# EAGLE design wifi-advent-wings (EAGLE 7.6.4)
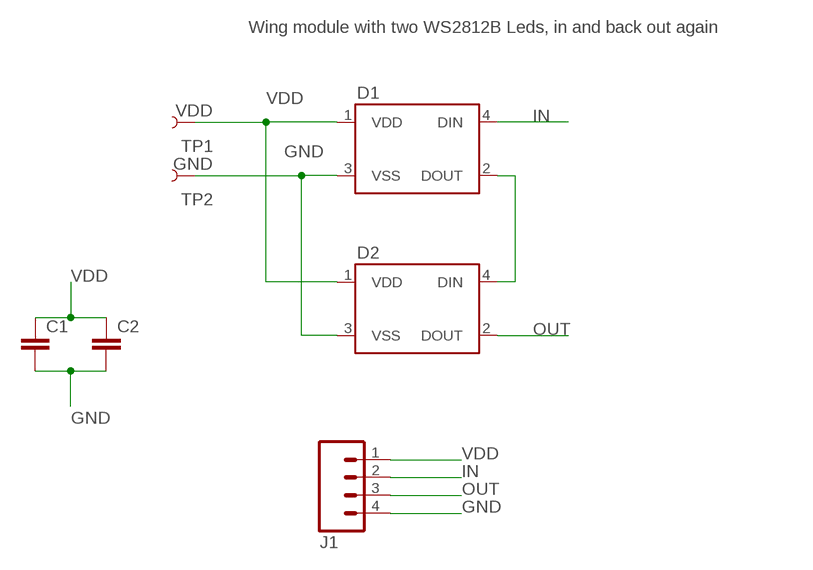
[diagram p0: schematic, sheet 1]

## Parts
C1  CAP0805  [0805]
C2  CAP0805  [0805]
D1  WS2812B  [WS2812B]
D2  WS2812B  [WS2812B]
J1  M041X04_NO_SILK  [1X04_NO_SILK]
TP1  VDD  TEST-POINT3  [PAD.03X.03]
TP2  GND  TEST-POINT3  [PAD.03X.03]

## Nets
GND: C1.2 C2.2 D1.3(VSS) D2.3(VSS) J1.4 TP2.P$1
IN: D1.4(DIN) J1.2
N$1: D1.2(DOUT) D2.4(DIN)
OUT: D2.2(DOUT) J1.3
VDD: C1.1 C2.1 D1.1(VDD) D2.1(VDD) J1.1 TP1.P$1

## Notes on the sheet
- Wing module with two WS2812B Leds, in and back out again

## Library data of the parts
C1 C2 = SparkFun-Passives:CAP: Capacitor Standard 0603 ceramic capacitor, and 0.1" leaded capacitor.
D1 D2 = karls-parts-2016-09:WS2812B: WS2812B - Intelligent control LED integrated light source Technical Specifications: Power Supply Voltage (VDD): 3.5 to 5.3 V Input Voltage (VI): -0.5 to VDD+0.5 V Operating Junction Temperature (Topt): -25°C to +80°C Storage Temperature Range (Tstg): -55°C to +150°C; PROD_ID: DIO-12503
J1 = SparkFun-Connectors:M04: Header 4 Standard 4-pin 0.1" header. Use with straight break away headers (SKU : PRT-00116), right angle break away headers (PRT-00553), swiss pins (PRT-00743), machine pins (PRT-00117), and female headers (PRT-00115). Molex polarized connector foot print use with SKU : PRT-08231 with associated crimp pins and housings. 1MM SMD Version SKU: PRT-10208; PROD_ID: CONN-09696
TP1 TP2 = SparkFun-Passives:TEST-POINT: Bare copper test points for troubleshooting or ICT

## Board
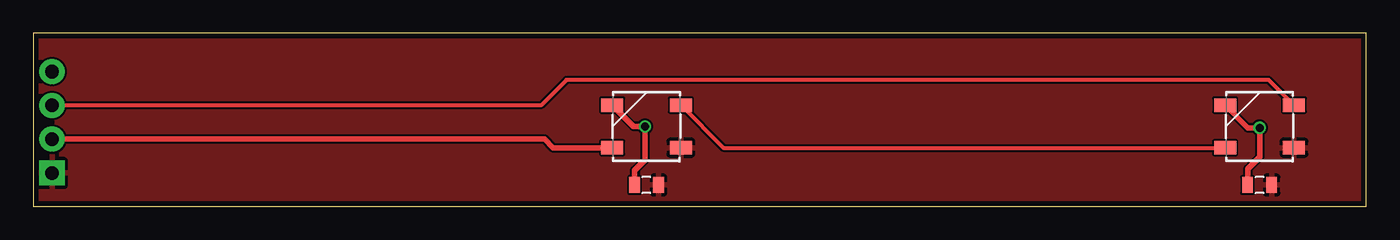
[diagram p1: board, top side]
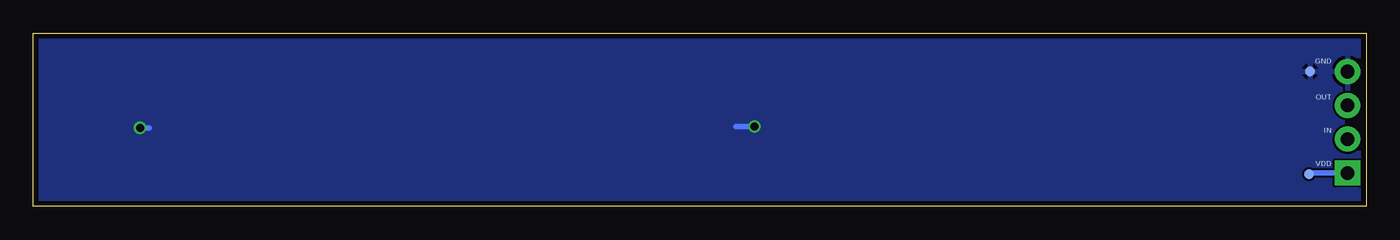
[diagram p2: board, bottom side, seen from below]

Size 100 x 13 mm. Coordinates in mm from the lower left corner, seen from the top.
Outline: 0,0 100,0 100,13 0,13 0,0
Copper layers (1*16): Top 0.035mm / dielectric 1.5mm / Bottom 0.035mm
Design rules "SeeedStudio_2layer_DRU_no_angle_20140221 *": minimum track width 6mil, minimum drill 12mil, track to track 6mil, track to pad 6mil, pad to pad 6mil, via to via 6mil, smd to smd 0mil, copper to edge 0.4mm, drill to drill 10mil, minimum pad ring 10mil, minimum via ring 6mil, stop-mask expansion 2mil, vias tented up to drill 100mil, thermal gap 10mil

### Footprints (pad centres in the part's own frame; a part is rotated, then mirrored left to right if it is on the bottom)
0805 = smd 0.8 x 1.2: 1 -0.9,0; 2 0.9,0
WS2812B = smd 1.651 x 1: 1 -2.577,1.6; 2 -2.577,-1.6; 3 2.577,-1.6; 4 2.577,1.6
1X04_NO_SILK = drill 1.016 pad 1.88 square: 1 0,0 | drill 1.016 pad 1.88: 2 2.54,0; 3 5.08,0; 4 7.62,0
PAD.03X.03 = smd 0.762 x 0.762: P$1 0,0

### Placement (x,y rotation side)
C1  46,1.6 180 top
C2  92,1.6 180 top
D1  46,6 180 top
D2  92,6 180 top
J1  1.4,2.5 90 top
TP1  4.27,2.42 0 bottom
TP2  4.21,10.12 0 bottom

### Tracks (layer width: path | path; a pad name or v marks a point on that pad's centre or on a via)
GND  (via drill 0.6)
  Top 0.406: D1.3 45.02,6 v45.9,6 45.9,3.5 45.1,2.7 C1.2 | D2.3 91.12,5.9 v92,5.9 92,3.7 91.1,2.8 C2.2
  Bottom 0.406: v45.9,6 47.3,6 | v92,5.9 91.3,5.9
  pour Bottom: 0.3,12.7 0.3,0.3 99.7,0.3 99.7,12.7
IN
  Top 0.406: J1.2 38.36,5.04 39,4.4 D1.4
N$1
  Top 0.305: D1.2 51.78,4.4 D2.4
OUT
  Top 0.305: D2.2 92.68,9.5 40,9.5 38.08,7.58 J1.3
VDD
  Bottom 0.406: J1.1 4.19,2.5 TP1.P$1
  pour Top: 0.3,12.7 99.7,12.7 99.7,0.3 0.3,0.3

### Text on the board
bNames: GND | OUT | IN | VDD